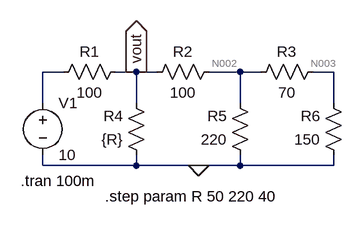
[diagram p0: schematic q1,2_sch.asc]
q1,2_sch.asc, the LTspice schematic file:
Version 4
SHEET 1 880 680
WIRE -64 64 -96 64
WIRE 48 64 16 64
WIRE 80 64 48 64
WIRE 208 64 160 64
WIRE 240 64 208 64
WIRE 352 64 320 64
WIRE -96 112 -96 64
WIRE 48 112 48 64
WIRE 208 112 208 64
WIRE 352 112 352 64
WIRE -96 208 -96 192
WIRE 48 208 48 192
WIRE 48 208 -96 208
WIRE 144 208 48 208
WIRE 208 208 208 192
WIRE 208 208 144 208
WIRE 352 208 352 192
WIRE 352 208 208 208
FLAG 144 208 0
FLAG 48 64 vout
IOPIN 48 64 Out
SYMBOL res 32 48 R90
WINDOW 0 0 56 VBottom 2
WINDOW 3 32 56 VTop 2
SYMATTR InstName R1
SYMATTR Value 100
SYMBOL res 176 48 R90
WINDOW 0 0 56 VBottom 2
WINDOW 3 32 56 VTop 2
SYMATTR InstName R2
SYMATTR Value 100
SYMBOL res 336 48 R90
WINDOW 0 0 56 VBottom 2
WINDOW 3 32 56 VTop 2
SYMATTR InstName R3
SYMATTR Value 70
SYMBOL res 64 208 R180
WINDOW 0 36 76 Left 2
WINDOW 3 36 40 Left 2
SYMATTR InstName R4
SYMATTR Value {R}
SYMBOL res 224 208 R180
WINDOW 0 36 76 Left 2
WINDOW 3 36 40 Left 2
SYMATTR InstName R5
SYMATTR Value 220
SYMBOL res 368 208 R180
WINDOW 0 36 76 Left 2
WINDOW 3 36 40 Left 2
SYMATTR InstName R6
SYMATTR Value 150
SYMBOL voltage -96 96 R0
WINDOW 123 0 0 Left 0
WINDOW 39 0 0 Left 0
SYMATTR InstName V1
SYMATTR Value 10
TEXT -130 232 Left 2 !.tran 100m
TEXT 0 256 Left 2 !.step param R 50 220 40

The netlist it stands for:
* q1,2_sch.asc
R1 vout N001 100
R2 N002 vout 100
R3 N003 N002 70
R4 0 vout {R}
R5 0 N002 220
R6 0 N003 150
V1 N001 0 10
.tran 100m
.step param R 50 220 40
.backanno
.end

* Results of the author's LTspice run, read from the files saved beside the schematic
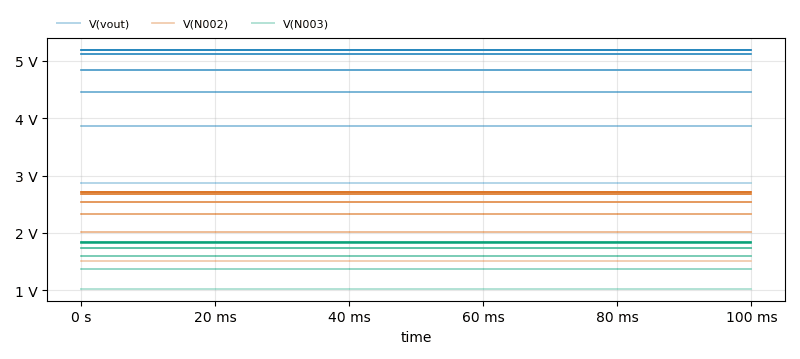
[diagram p1: Transient Analysis of q1,2_sch.asc, plotted from the saved traces]
* Transient Analysis, 6 runs:
*   V(vout) [r=50]: min 2.877 V, max 2.877 V, average 2.877 V, rms 2.877 V, last 2.877 V
*   V(vout) [r=90]: min 3.865 V, max 3.865 V, average 3.865 V, rms 3.865 V, last 3.865 V
*   V(vout) [r=130]: min 4.454 V, max 4.454 V, average 4.454 V, rms 4.454 V, last 4.454 V
*   V(vout) [r=170]: min 4.844 V, max 4.844 V, average 4.844 V, rms 4.844 V, last 4.844 V
*   V(vout) [r=210]: min 5.122 V, max 5.122 V, average 5.122 V, rms 5.122 V, last 5.122 V
*   V(vout) [r=220]: min 5.179 V, max 5.179 V, average 5.179 V, rms 5.179 V, last 5.179 V
*   V(N002) [r=50]: min 1.507 V, max 1.507 V, average 1.507 V, rms 1.507 V, last 1.507 V
*   V(N002) [r=90]: min 2.025 V, max 2.025 V, average 2.025 V, rms 2.025 V, last 2.025 V
*   V(N002) [r=130]: min 2.333 V, max 2.333 V, average 2.333 V, rms 2.333 V, last 2.333 V
*   V(N002) [r=170]: min 2.537 V, max 2.537 V, average 2.537 V, rms 2.537 V, last 2.537 V
*   V(N002) [r=210]: min 2.683 V, max 2.683 V, average 2.683 V, rms 2.683 V, last 2.683 V
*   V(N002) [r=220]: min 2.713 V, max 2.713 V, average 2.713 V, rms 2.713 V, last 2.713 V
*   V(N003) [r=50]: min 1.027 V, max 1.027 V, average 1.027 V, rms 1.027 V, last 1.027 V
*   V(N003) [r=90]: min 1.38 V, max 1.38 V, average 1.38 V, rms 1.38 V, last 1.38 V
*   V(N003) [r=130]: min 1.591 V, max 1.591 V, average 1.591 V, rms 1.591 V, last 1.591 V
*   V(N003) [r=170]: min 1.73 V, max 1.73 V, average 1.73 V, rms 1.73 V, last 1.73 V
*   V(N003) [r=210]: min 1.829 V, max 1.829 V, average 1.829 V, rms 1.829 V, last 1.829 V
*   V(N003) [r=220]: min 1.85 V, max 1.85 V, average 1.85 V, rms 1.85 V, last 1.85 V